# EAGLE design dogs102_3.3v_v0.5 (EAGLE 7.3.0)
Assembly variants: DOGM132-5 monochrome, DOGM132-5 RGB, DOGML128 monochrome, DOGML128 RGB
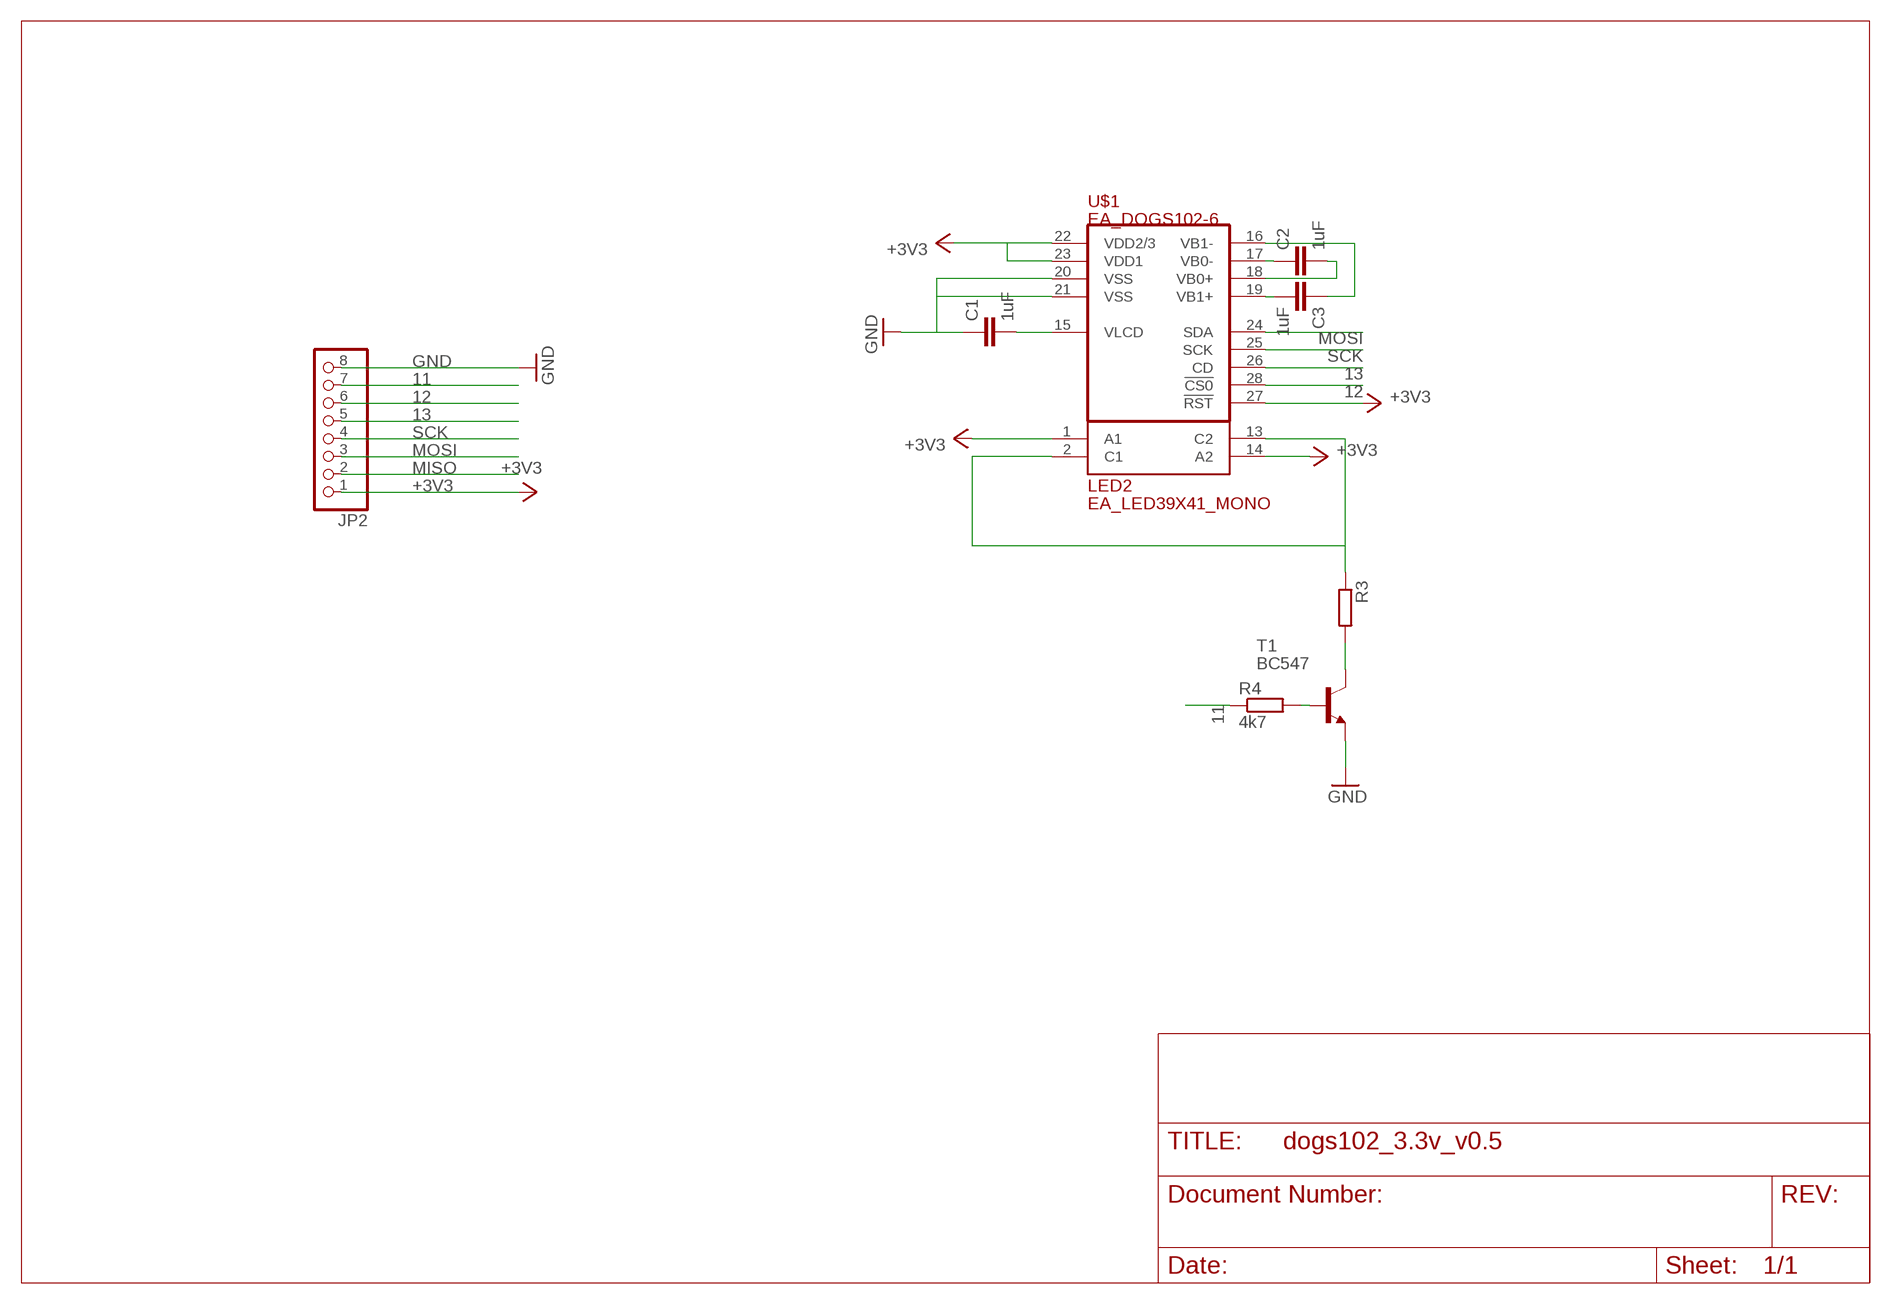
[diagram p0: schematic, sheet 1]

## Parts
C1  1uF  C-EU050-035X075  [C050-035X075]
C2  1uF  C-EU050-035X075  [C050-035X075]
C3  1uF  C-EU050-035X075  [C050-035X075]
JP2  PINHD-1X8  [1X08]
LED2  EA_LED39X41_MONO  [EA_LED39X41]
R3  R-EU_0204/2V  [0204V]
R4  4k7  R-EU_0204/2V  [0204V]
T1  BC547  BC547-NPN-TO92-CBE  [TO92-CBE]
U$1  EA_DOGS102-6  [EA_DOGS102-6]

## Nets
11: JP2.7 R4.1
12: JP2.6 U$1.28(!CS0!)
13: JP2.5 U$1.26(CD)
+3V3: JP2.1 LED2.1(A1) LED2.14(A2) U$1.22(VDD2/3) U$1.23(VDD1) U$1.27(!RST!)
GND: C1.1 JP2.8 T1.E U$1.20(VSS) U$1.21(VSS)
LCD_LED_OUT: LED2.2(C1) LED2.13(C2) R3.1
MISO: JP2.2
MOSI: JP2.3 U$1.24(SDA)
N$1: C2.1 U$1.17(VB0-)
N$2: C2.2 U$1.18(VB0+)
N$3: C3.2 U$1.19(VB1+)
N$4: C3.1 U$1.16(VB1-)
N$5: C1.2 U$1.15(VLCD)
N$7: R3.2 T1.C
N$8: R4.2 T1.B
SCK: JP2.4 U$1.25(SCK)

## Library data of the parts
C1-C3 = rcl:C-EU: CAPACITOR, European symbol
JP2 = pinhead:PINHD-1X8: PIN HEADER
LED2 = ea:EA_LED39X41_MONO: Manufacturer: ELECTRONIC ASSEMBLY GmbH EA LED39x41-A EA LED39x41-W EA LED39x41-GR
R3 R4 = rcl:R-EU_: RESISTOR, European symbol
T1 = transistor:*-NPN-: NPN Transistror BF959 corrected 2008.03.06
U$1 = ea:EA_DOGS102-6

## Board
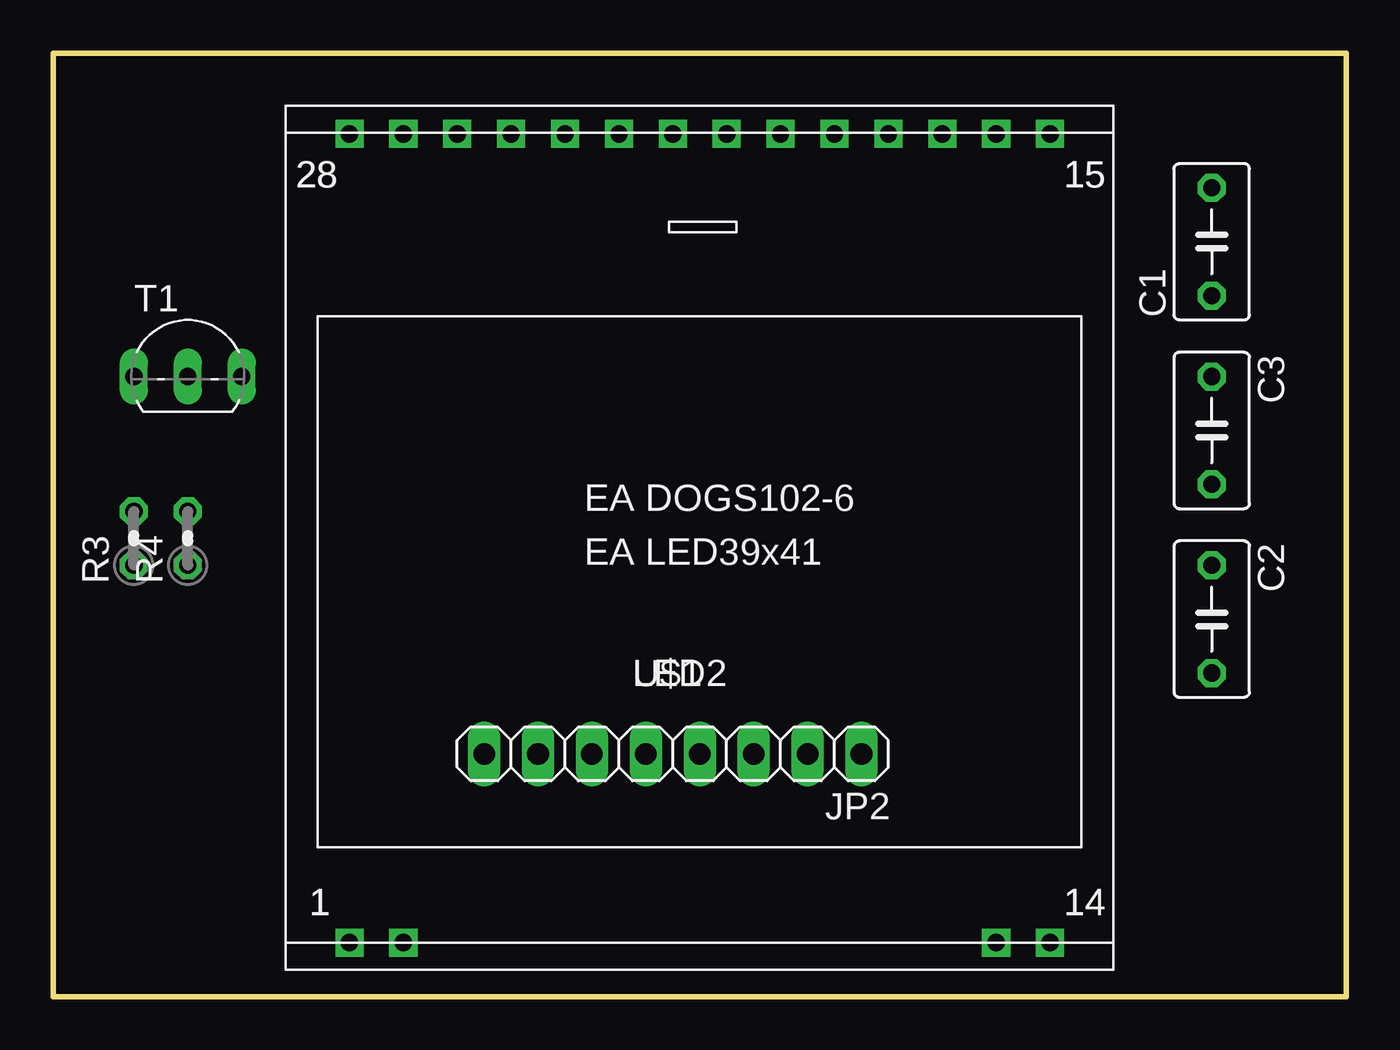
[diagram p1: board, top side]
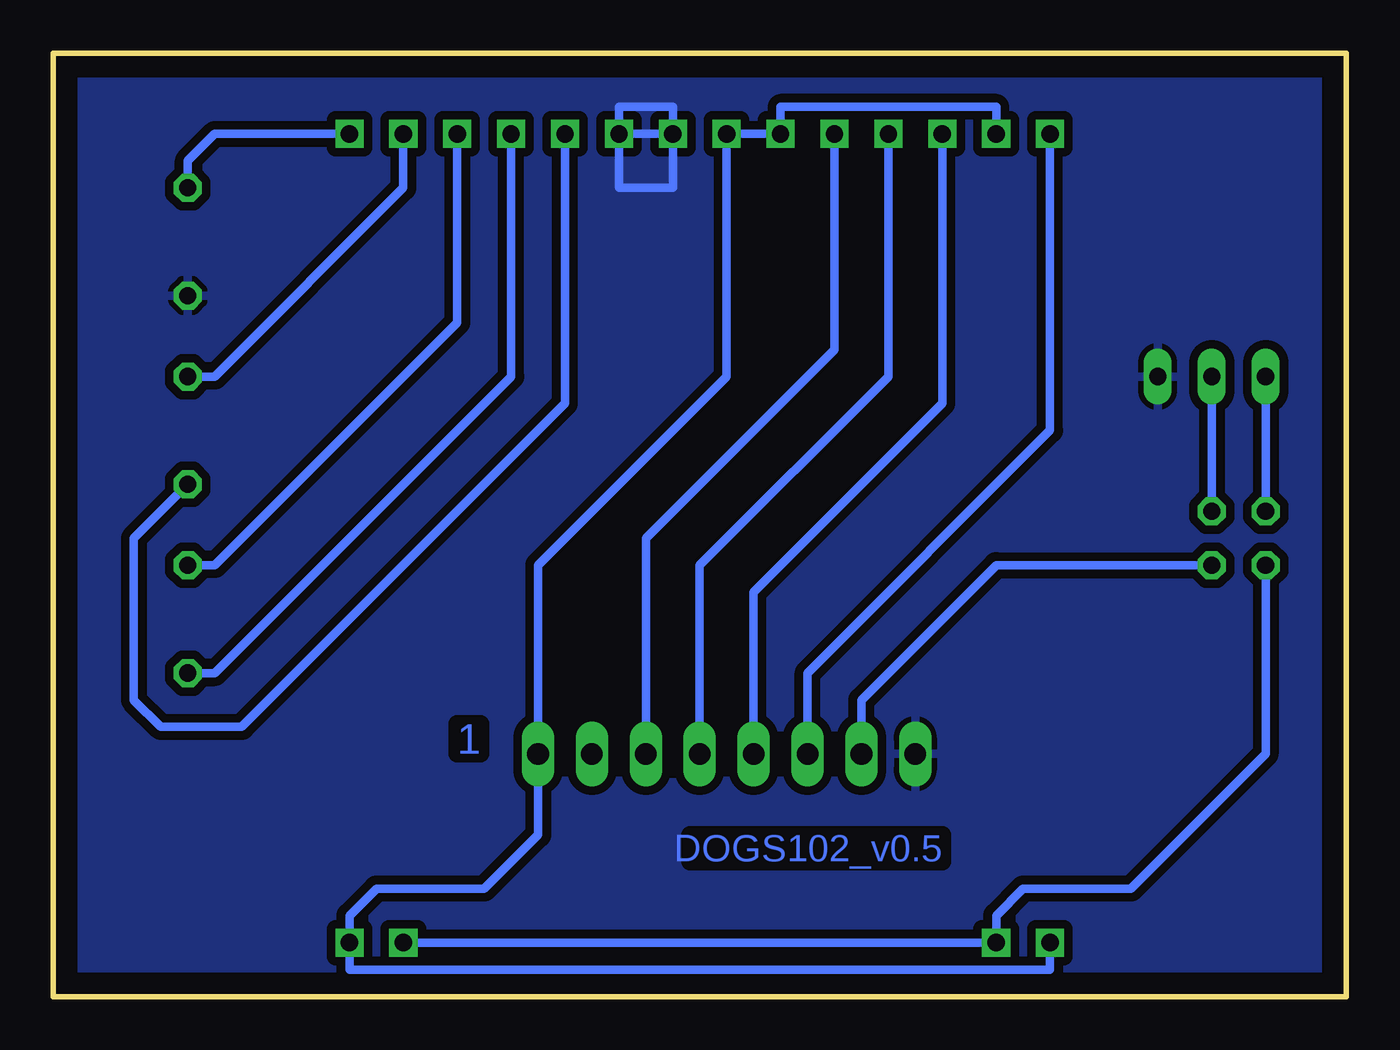
[diagram p2: board, bottom side, seen from below]

Size 60.96 x 44.45 mm. Coordinates in mm from the lower left corner, seen from the top.
Outline: 0,0 60.96,0 60.96,44.45 0,44.45 0,0
Copper layers (1*16): Top 0.035mm / dielectric 1.5mm / Bottom 0.035mm
Design rules "default *": minimum track width 10mil, minimum drill 24mil, track to track 16mil, track to pad 16mil, pad to pad 12mil, via to via 12mil, smd to smd 8mil, copper to edge 40mil, drill to drill 10mil, minimum pad ring 10mil, minimum via ring 8mil, stop-mask expansion 4mil, vias tented up to drill 0mil, thermal gap 10mil

### Footprints (pad centres in the part's own frame; a part is rotated, then mirrored left to right if it is on the bottom)
C050-035X075 = drill 0.813 octagon: 1 -2.54,0; 2 2.54,0
1X08 = drill 1.016 long: 1 -8.89,0; 2 -6.35,0; 3 -3.81,0; 4 -1.27,0; 5 1.27,0; 6 3.81,0; 7 6.35,0; 8 8.89,0
EA_LED39X41 = drill 0.813 square: 1 0,0; 2 2.54,0; 13 30.48,0; 14 33.02,0; 15 33.02,38.1; 16 30.48,38.1; 17 27.94,38.1; 18 25.4,38.1; 19 22.86,38.1; 20 20.32,38.1; 21 17.78,38.1; 22 15.24,38.1; 23 12.7,38.1; 24 10.16,38.1; 25 7.62,38.1; 26 5.08,38.1; 27 2.54,38.1; 28 0,38.1
0204V = drill 0.813 octagon: 1 -1.27,0; 2 1.27,0
TO92-CBE = drill 0.813 long: B 0,0; C -2.54,0; E 2.54,0
EA_DOGS102-6 = drill 0.813 square: 1 0,0; 2 2.54,0; 13 30.48,0; 14 33.02,0; 15 33.02,38.1; 16 30.48,38.1; 17 27.94,38.1; 18 25.4,38.1; 19 22.86,38.1; 20 20.32,38.1; 21 17.78,38.1; 22 15.24,38.1; 23 12.7,38.1; 24 10.16,38.1; 25 7.62,38.1; 26 5.08,38.1; 27 2.54,38.1; 28 0,38.1

### Placement (x,y rotation side)
C1  54.61,35.56 90 top
C2  54.61,17.78 270 top
C3  54.61,26.67 270 top
JP2  29.21,11.43 180 top
LED2  13.97,2.54 0 top
R3  3.81,21.59 90 top
R4  6.35,21.59 90 top
T1  6.35,29.21 0 top
U$1  13.97,2.54 0 top

### Tracks (layer width: path | path; a pad name or v marks a point on that pad's centre or on a via)
11
  Bottom 0.406: JP2.7 22.86,13.97 16.51,20.32 R4.1
12
  Bottom 0.406: JP2.6 25.4,15.24 13.97,26.67 U$1.28
13
  Bottom 0.406: JP2.5 27.94,19.05 19.05,27.94 U$1.26
+3V3
  Bottom 0.406: LED2.1 13.97,1.27 46.99,1.27 LED2.14 46.99,3.81 45.72,5.08 40.64,5.08 38.1,7.62 JP2.1 38.1,20.32 29.21,29.21 U$1.22 U$1.23 26.67,41.91 16.51,41.91 U$1.27
GND
  Bottom 0.406: U$1.20 U$1.21 | U$1.20 34.29,38.1 31.75,38.1 U$1.21 | U$1.21 31.75,41.91 34.29,41.91 U$1.20
  pour Bottom: -1.27,44.45 -1.27,0 62.23,0 62.23,44.45
LCD_LED_OUT
  Bottom 0.406: LED2.13 LED2.2 16.51,3.81 15.24,5.08 10.16,5.08 3.81,11.43 R3.1
MOSI
  Bottom 0.406: U$1.24 24.13,30.48 33.02,21.59 JP2.3
N$1
  Bottom 0.406: U$1.17 41.91,31.75 53.34,20.32 C2.1
N$2
  Bottom 0.406: C2.2 53.34,15.24 39.37,29.21 U$1.18
N$3
  Bottom 0.406: C3.2 57.15,21.59 57.15,13.97 55.88,12.7 52.07,12.7 36.83,27.94 U$1.19
N$4
  Bottom 0.406: U$1.16 44.45,38.1 53.34,29.21 C3.1
N$5
  Bottom 0.406: C1.2 54.61,39.37 53.34,40.64 U$1.15
N$7
  Bottom 0.406: T1.C R3.2
N$8
  Bottom 0.406: T1.B R4.2
SCK
  Bottom 0.406: JP2.4 30.48,20.32 21.59,29.21 U$1.25

### Text on the board
Bottom: 1 | DOGS102_v0.5